# EAGLE schematic untitled (EAGLE 9.6.2)
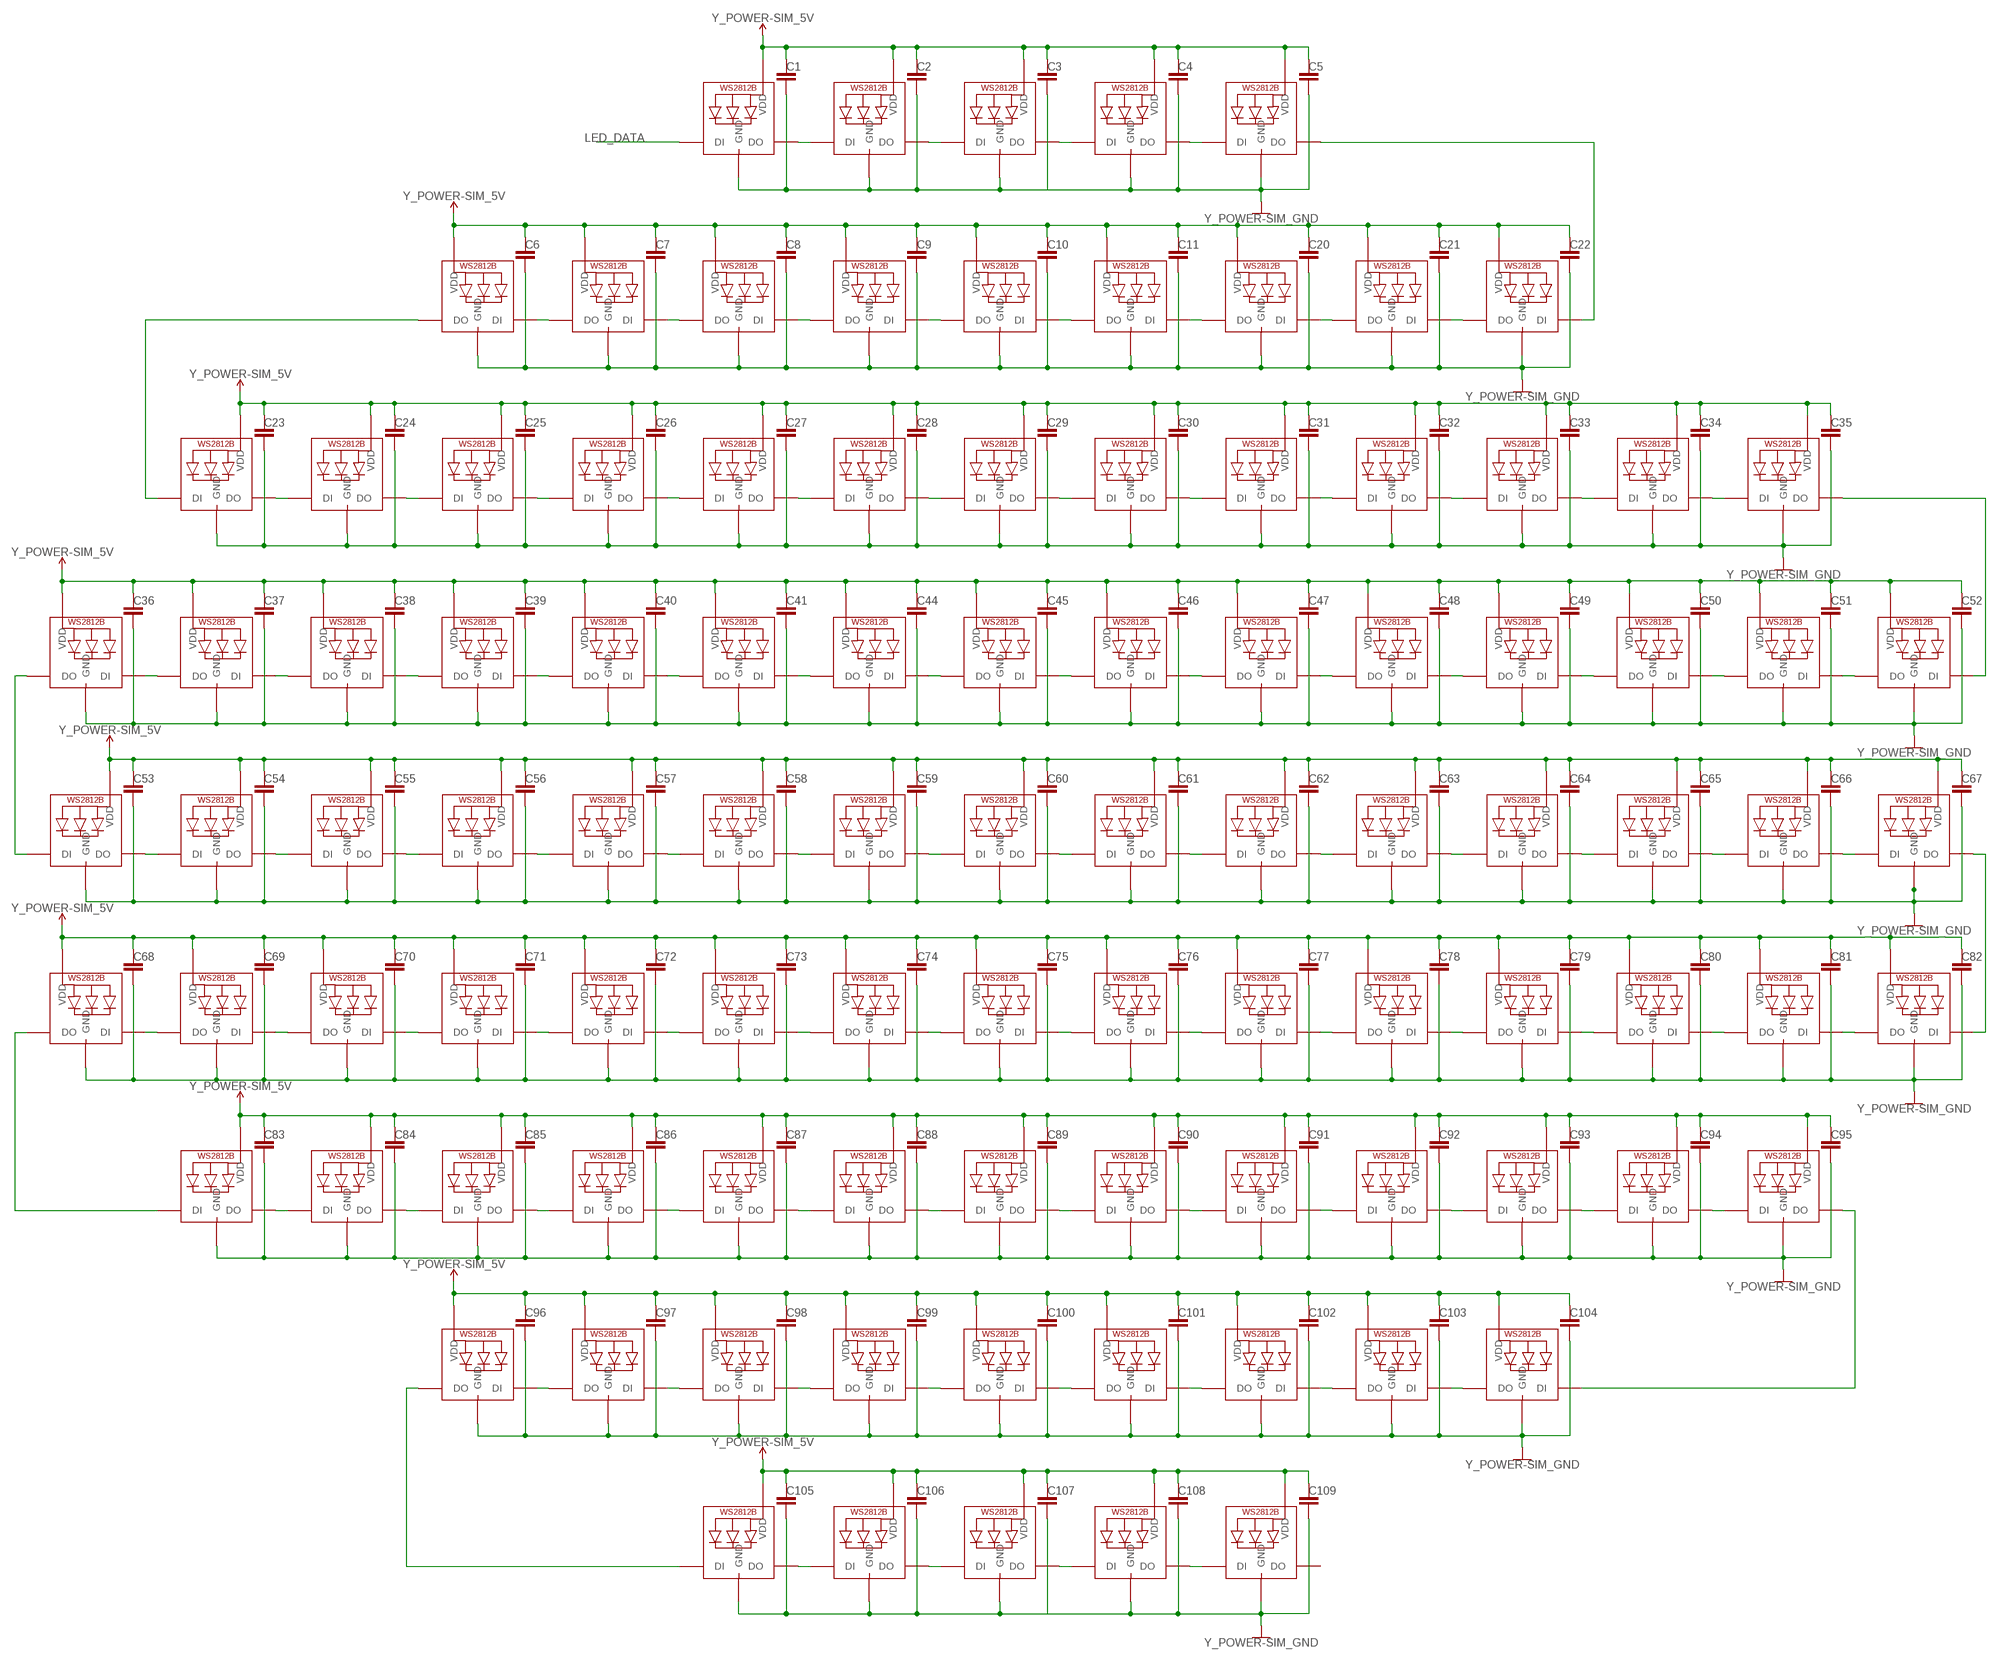
[diagram p0: schematic, sheet 1, part 1 of 2]
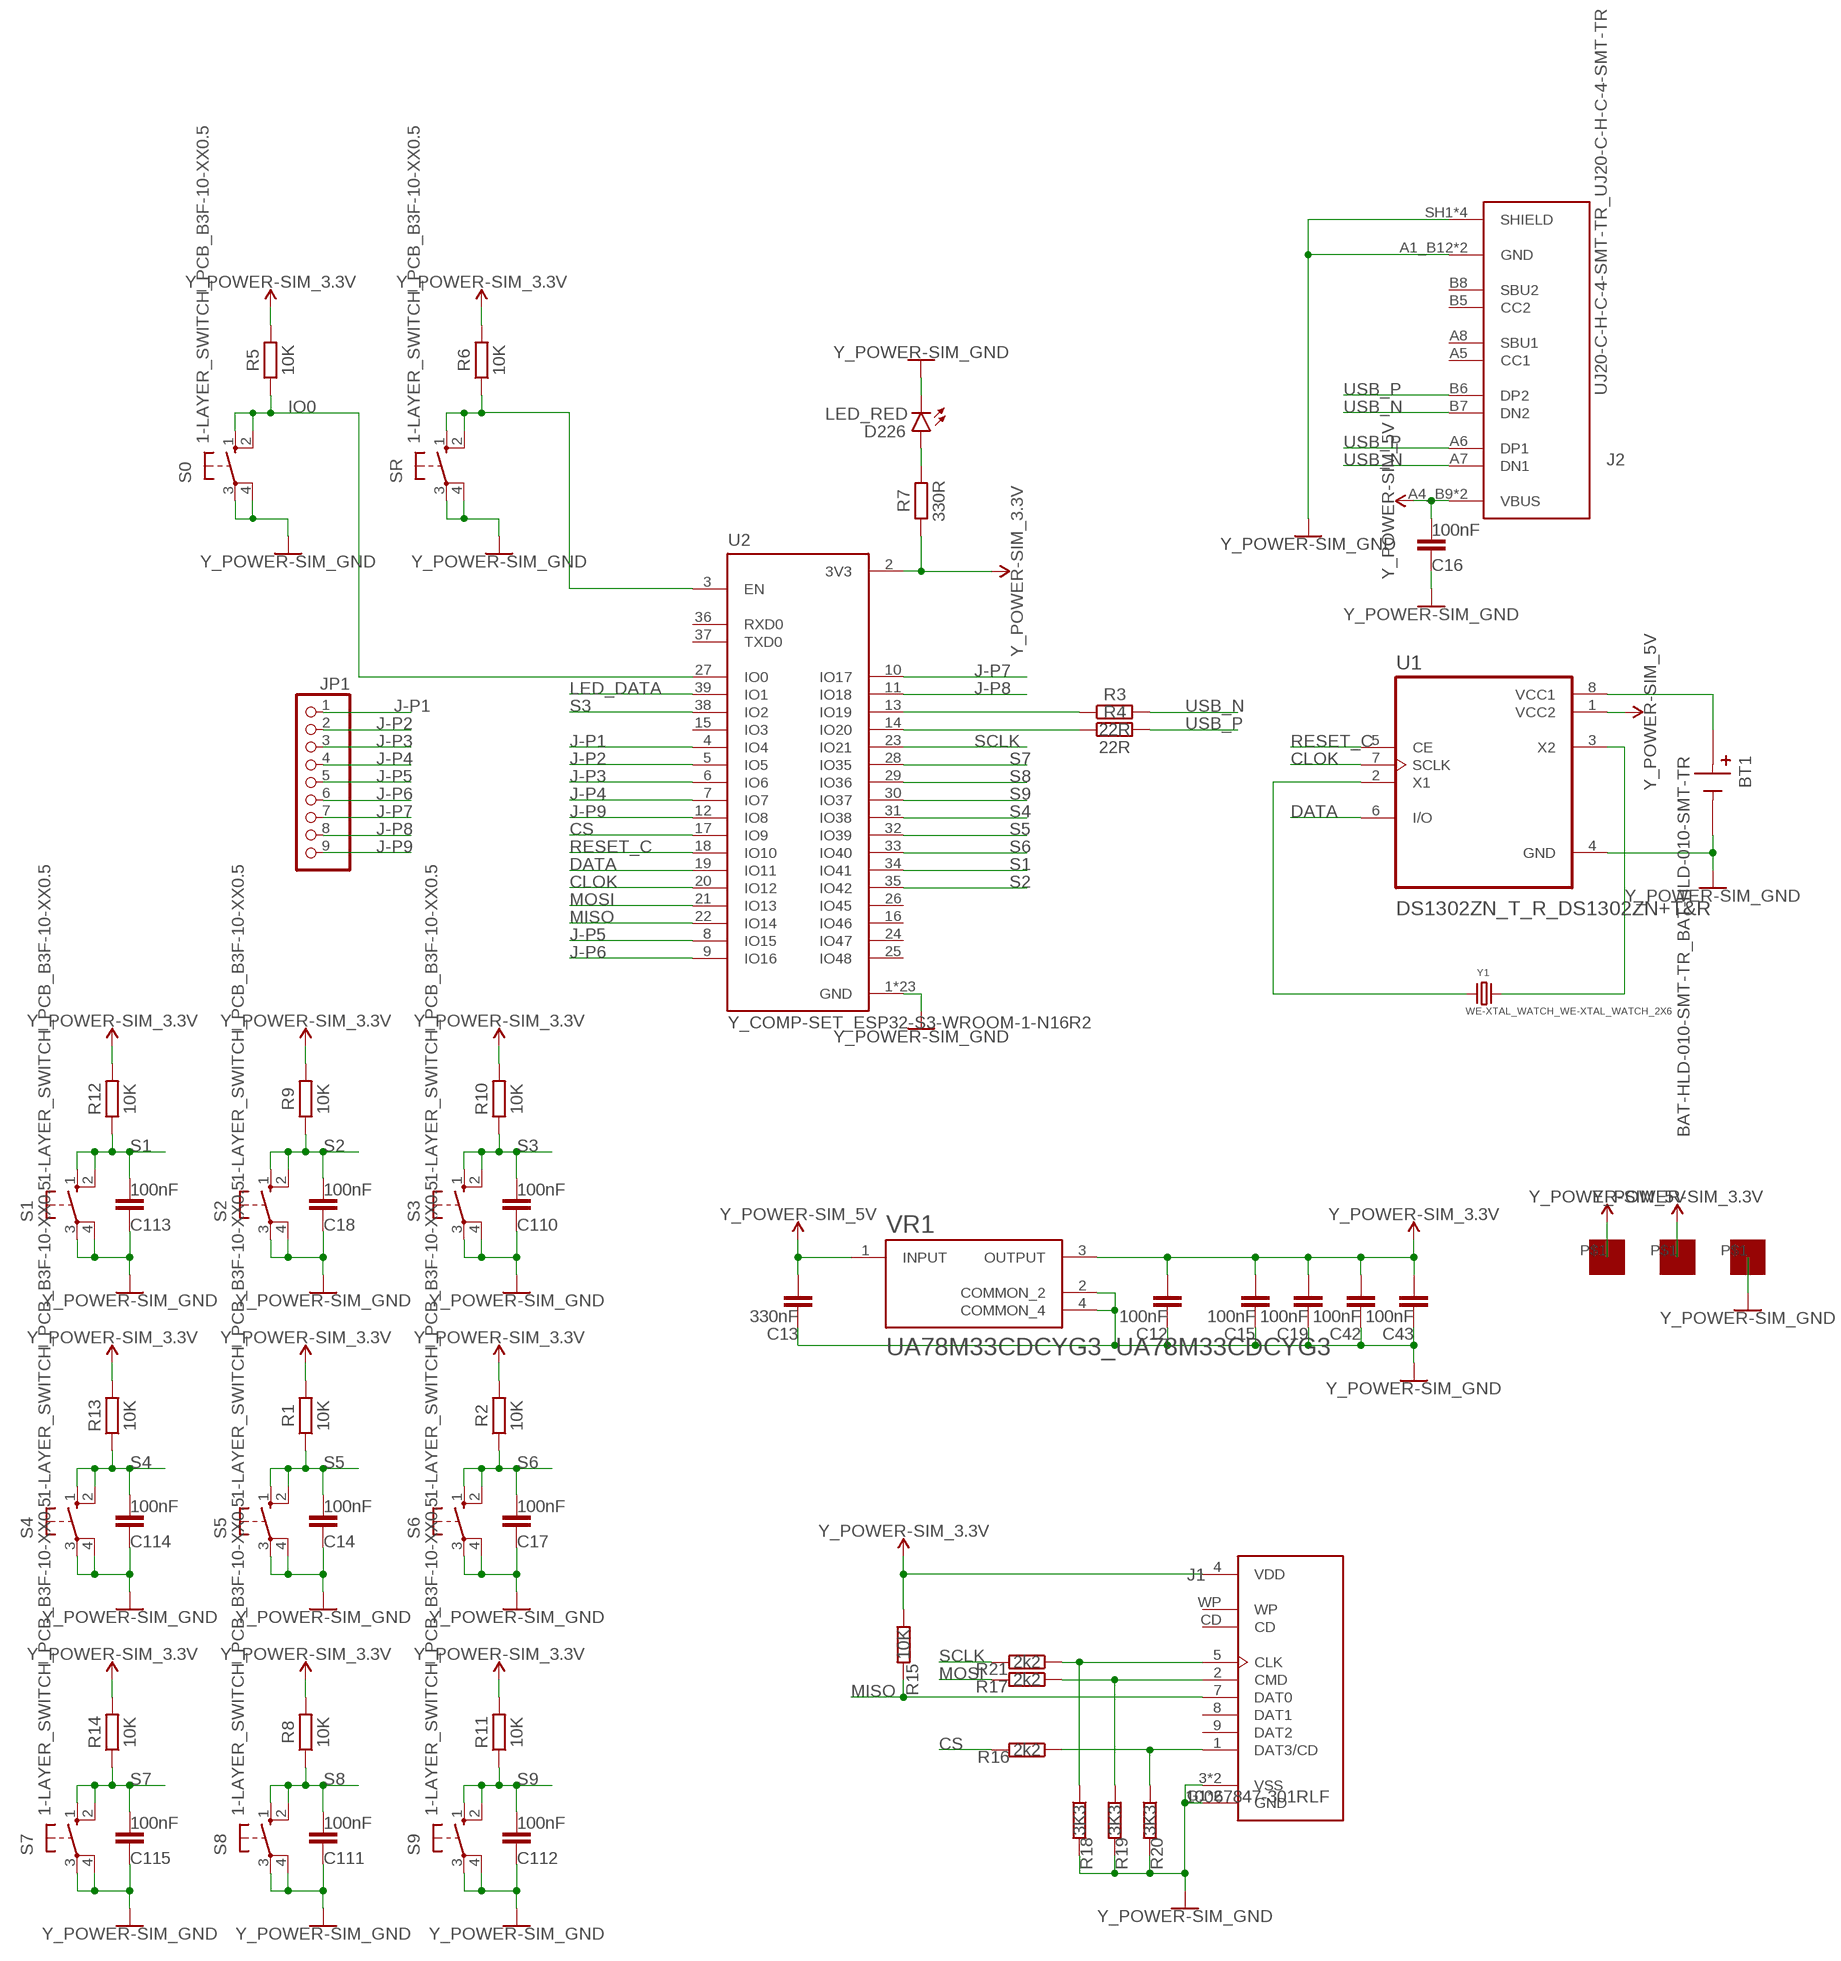
[diagram p1: schematic, sheet 1, part 2 of 2]

## Parts
BT1  BAT-HLD-010-SMT-TR_BAT-HLD-010-SMT-TR  [BAT-HLD-010-SMT-TR_BAT_BAT-HLD-010-SMT-TR]
C1  Y-CAP_C_CHIP-0805(2012-METRIC)  [Y-CAP_CAPC2012X110]
C2  Y-CAP_C_CHIP-0805(2012-METRIC)  [Y-CAP_CAPC2012X110]
C3  Y-CAP_C_CHIP-0805(2012-METRIC)  [Y-CAP_CAPC2012X110]
C4  Y-CAP_C_CHIP-0805(2012-METRIC)  [Y-CAP_CAPC2012X110]
C5  Y-CAP_C_CHIP-0805(2012-METRIC)  [Y-CAP_CAPC2012X110]
C6  Y-CAP_C_CHIP-0805(2012-METRIC)  [Y-CAP_CAPC2012X110]
C7  Y-CAP_C_CHIP-0805(2012-METRIC)  [Y-CAP_CAPC2012X110]
C8  Y-CAP_C_CHIP-0805(2012-METRIC)  [Y-CAP_CAPC2012X110]
C9  Y-CAP_C_CHIP-0805(2012-METRIC)  [Y-CAP_CAPC2012X110]
C10  Y-CAP_C_CHIP-0805(2012-METRIC)  [Y-CAP_CAPC2012X110]
C11  Y-CAP_C_CHIP-0805(2012-METRIC)  [Y-CAP_CAPC2012X110]
C12  100nF  Y-CAP_C_CHIP-0805(2012-METRIC)  [Y-CAP_CAPC2012X110]
C13  330nF  Y-CAP_C_CHIP-0805(2012-METRIC)  [Y-CAP_CAPC2012X110]
C14  100nF  Y-CAP_C_CHIP-0805(2012-METRIC)  [Y-CAP_CAPC2012X110]
C15  100nF  Y-CAP_C_CHIP-0805(2012-METRIC)  [Y-CAP_CAPC2012X110]
C16  100nF  Y-CAP_C_CHIP-0805(2012-METRIC)  [Y-CAP_CAPC2012X110]
C17  100nF  Y-CAP_C_CHIP-0805(2012-METRIC)  [Y-CAP_CAPC2012X110]
C18  100nF  Y-CAP_C_CHIP-0805(2012-METRIC)  [Y-CAP_CAPC2012X110]
C19  100nF  Y-CAP_C_CHIP-0805(2012-METRIC)  [Y-CAP_CAPC2012X110]
C20  Y-CAP_C_CHIP-0805(2012-METRIC)  [Y-CAP_CAPC2012X110]
C21  Y-CAP_C_CHIP-0805(2012-METRIC)  [Y-CAP_CAPC2012X110]
C22  Y-CAP_C_CHIP-0805(2012-METRIC)  [Y-CAP_CAPC2012X110]
C23  Y-CAP_C_CHIP-0805(2012-METRIC)  [Y-CAP_CAPC2012X110]
C24  Y-CAP_C_CHIP-0805(2012-METRIC)  [Y-CAP_CAPC2012X110]
C25  Y-CAP_C_CHIP-0805(2012-METRIC)  [Y-CAP_CAPC2012X110]
C26  Y-CAP_C_CHIP-0805(2012-METRIC)  [Y-CAP_CAPC2012X110]
C27  Y-CAP_C_CHIP-0805(2012-METRIC)  [Y-CAP_CAPC2012X110]
C28  Y-CAP_C_CHIP-0805(2012-METRIC)  [Y-CAP_CAPC2012X110]
C29  Y-CAP_C_CHIP-0805(2012-METRIC)  [Y-CAP_CAPC2012X110]
C30  Y-CAP_C_CHIP-0805(2012-METRIC)  [Y-CAP_CAPC2012X110]
C31  Y-CAP_C_CHIP-0805(2012-METRIC)  [Y-CAP_CAPC2012X110]
C32  Y-CAP_C_CHIP-0805(2012-METRIC)  [Y-CAP_CAPC2012X110]
C33  Y-CAP_C_CHIP-0805(2012-METRIC)  [Y-CAP_CAPC2012X110]
C34  Y-CAP_C_CHIP-0805(2012-METRIC)  [Y-CAP_CAPC2012X110]
C35  Y-CAP_C_CHIP-0805(2012-METRIC)  [Y-CAP_CAPC2012X110]
C36  Y-CAP_C_CHIP-0805(2012-METRIC)  [Y-CAP_CAPC2012X110]
C37  Y-CAP_C_CHIP-0805(2012-METRIC)  [Y-CAP_CAPC2012X110]
C38  Y-CAP_C_CHIP-0805(2012-METRIC)  [Y-CAP_CAPC2012X110]
C39  Y-CAP_C_CHIP-0805(2012-METRIC)  [Y-CAP_CAPC2012X110]
C40  Y-CAP_C_CHIP-0805(2012-METRIC)  [Y-CAP_CAPC2012X110]
C41  Y-CAP_C_CHIP-0805(2012-METRIC)  [Y-CAP_CAPC2012X110]
C42  100nF  Y-CAP_C_CHIP-0805(2012-METRIC)  [Y-CAP_CAPC2012X110]
C43  100nF  Y-CAP_C_CHIP-0805(2012-METRIC)  [Y-CAP_CAPC2012X110]
C44  Y-CAP_C_CHIP-0805(2012-METRIC)  [Y-CAP_CAPC2012X110]
C45  Y-CAP_C_CHIP-0805(2012-METRIC)  [Y-CAP_CAPC2012X110]
C46  Y-CAP_C_CHIP-0805(2012-METRIC)  [Y-CAP_CAPC2012X110]
C47  Y-CAP_C_CHIP-0805(2012-METRIC)  [Y-CAP_CAPC2012X110]
C48  Y-CAP_C_CHIP-0805(2012-METRIC)  [Y-CAP_CAPC2012X110]
C49  Y-CAP_C_CHIP-0805(2012-METRIC)  [Y-CAP_CAPC2012X110]
C50  Y-CAP_C_CHIP-0805(2012-METRIC)  [Y-CAP_CAPC2012X110]
C51  Y-CAP_C_CHIP-0805(2012-METRIC)  [Y-CAP_CAPC2012X110]
C52  Y-CAP_C_CHIP-0805(2012-METRIC)  [Y-CAP_CAPC2012X110]
C53  Y-CAP_C_CHIP-0805(2012-METRIC)  [Y-CAP_CAPC2012X110]
C54  Y-CAP_C_CHIP-0805(2012-METRIC)  [Y-CAP_CAPC2012X110]
C55  Y-CAP_C_CHIP-0805(2012-METRIC)  [Y-CAP_CAPC2012X110]
C56  Y-CAP_C_CHIP-0805(2012-METRIC)  [Y-CAP_CAPC2012X110]
C57  Y-CAP_C_CHIP-0805(2012-METRIC)  [Y-CAP_CAPC2012X110]
C58  Y-CAP_C_CHIP-0805(2012-METRIC)  [Y-CAP_CAPC2012X110]
C59  Y-CAP_C_CHIP-0805(2012-METRIC)  [Y-CAP_CAPC2012X110]
C60  Y-CAP_C_CHIP-0805(2012-METRIC)  [Y-CAP_CAPC2012X110]
C61  Y-CAP_C_CHIP-0805(2012-METRIC)  [Y-CAP_CAPC2012X110]
C62  Y-CAP_C_CHIP-0805(2012-METRIC)  [Y-CAP_CAPC2012X110]
C63  Y-CAP_C_CHIP-0805(2012-METRIC)  [Y-CAP_CAPC2012X110]
C64  Y-CAP_C_CHIP-0805(2012-METRIC)  [Y-CAP_CAPC2012X110]
C65  Y-CAP_C_CHIP-0805(2012-METRIC)  [Y-CAP_CAPC2012X110]
C66  Y-CAP_C_CHIP-0805(2012-METRIC)  [Y-CAP_CAPC2012X110]
C67  Y-CAP_C_CHIP-0805(2012-METRIC)  [Y-CAP_CAPC2012X110]
C68  Y-CAP_C_CHIP-0805(2012-METRIC)  [Y-CAP_CAPC2012X110]
C69  Y-CAP_C_CHIP-0805(2012-METRIC)  [Y-CAP_CAPC2012X110]
C70  Y-CAP_C_CHIP-0805(2012-METRIC)  [Y-CAP_CAPC2012X110]
C71  Y-CAP_C_CHIP-0805(2012-METRIC)  [Y-CAP_CAPC2012X110]
C72  Y-CAP_C_CHIP-0805(2012-METRIC)  [Y-CAP_CAPC2012X110]
C73  Y-CAP_C_CHIP-0805(2012-METRIC)  [Y-CAP_CAPC2012X110]
C74  Y-CAP_C_CHIP-0805(2012-METRIC)  [Y-CAP_CAPC2012X110]
C75  Y-CAP_C_CHIP-0805(2012-METRIC)  [Y-CAP_CAPC2012X110]
C76  Y-CAP_C_CHIP-0805(2012-METRIC)  [Y-CAP_CAPC2012X110]
C77  Y-CAP_C_CHIP-0805(2012-METRIC)  [Y-CAP_CAPC2012X110]
C78  Y-CAP_C_CHIP-0805(2012-METRIC)  [Y-CAP_CAPC2012X110]
C79  Y-CAP_C_CHIP-0805(2012-METRIC)  [Y-CAP_CAPC2012X110]
C80  Y-CAP_C_CHIP-0805(2012-METRIC)  [Y-CAP_CAPC2012X110]
C81  Y-CAP_C_CHIP-0805(2012-METRIC)  [Y-CAP_CAPC2012X110]
C82  Y-CAP_C_CHIP-0805(2012-METRIC)  [Y-CAP_CAPC2012X110]
C83  Y-CAP_C_CHIP-0805(2012-METRIC)  [Y-CAP_CAPC2012X110]
C84  Y-CAP_C_CHIP-0805(2012-METRIC)  [Y-CAP_CAPC2012X110]
C85  Y-CAP_C_CHIP-0805(2012-METRIC)  [Y-CAP_CAPC2012X110]
C86  Y-CAP_C_CHIP-0805(2012-METRIC)  [Y-CAP_CAPC2012X110]
C87  Y-CAP_C_CHIP-0805(2012-METRIC)  [Y-CAP_CAPC2012X110]
C88  Y-CAP_C_CHIP-0805(2012-METRIC)  [Y-CAP_CAPC2012X110]
C89  Y-CAP_C_CHIP-0805(2012-METRIC)  [Y-CAP_CAPC2012X110]
C90  Y-CAP_C_CHIP-0805(2012-METRIC)  [Y-CAP_CAPC2012X110]
C91  Y-CAP_C_CHIP-0805(2012-METRIC)  [Y-CAP_CAPC2012X110]
C92  Y-CAP_C_CHIP-0805(2012-METRIC)  [Y-CAP_CAPC2012X110]
C93  Y-CAP_C_CHIP-0805(2012-METRIC)  [Y-CAP_CAPC2012X110]
C94  Y-CAP_C_CHIP-0805(2012-METRIC)  [Y-CAP_CAPC2012X110]
C95  Y-CAP_C_CHIP-0805(2012-METRIC)  [Y-CAP_CAPC2012X110]
C96  Y-CAP_C_CHIP-0805(2012-METRIC)  [Y-CAP_CAPC2012X110]
C97  Y-CAP_C_CHIP-0805(2012-METRIC)  [Y-CAP_CAPC2012X110]
C98  Y-CAP_C_CHIP-0805(2012-METRIC)  [Y-CAP_CAPC2012X110]
C99  Y-CAP_C_CHIP-0805(2012-METRIC)  [Y-CAP_CAPC2012X110]
C100  Y-CAP_C_CHIP-0805(2012-METRIC)  [Y-CAP_CAPC2012X110]
C101  Y-CAP_C_CHIP-0805(2012-METRIC)  [Y-CAP_CAPC2012X110]
C102  Y-CAP_C_CHIP-0805(2012-METRIC)  [Y-CAP_CAPC2012X110]
C103  Y-CAP_C_CHIP-0805(2012-METRIC)  [Y-CAP_CAPC2012X110]
C104  Y-CAP_C_CHIP-0805(2012-METRIC)  [Y-CAP_CAPC2012X110]
C105  Y-CAP_C_CHIP-0805(2012-METRIC)  [Y-CAP_CAPC2012X110]
C106  Y-CAP_C_CHIP-0805(2012-METRIC)  [Y-CAP_CAPC2012X110]
C107  Y-CAP_C_CHIP-0805(2012-METRIC)  [Y-CAP_CAPC2012X110]
C108  Y-CAP_C_CHIP-0805(2012-METRIC)  [Y-CAP_CAPC2012X110]
C109  Y-CAP_C_CHIP-0805(2012-METRIC)  [Y-CAP_CAPC2012X110]
C110  100nF  Y-CAP_C_CHIP-0805(2012-METRIC)  [Y-CAP_CAPC2012X110]
C111  100nF  Y-CAP_C_CHIP-0805(2012-METRIC)  [Y-CAP_CAPC2012X110]
C112  100nF  Y-CAP_C_CHIP-0805(2012-METRIC)  [Y-CAP_CAPC2012X110]
C113  100nF  Y-CAP_C_CHIP-0805(2012-METRIC)  [Y-CAP_CAPC2012X110]
C114  100nF  Y-CAP_C_CHIP-0805(2012-METRIC)  [Y-CAP_CAPC2012X110]
C115  100nF  Y-CAP_C_CHIP-0805(2012-METRIC)  [Y-CAP_CAPC2012X110]
D226  LED_RED  1-LAYER_LED/R/5MM_0.5  [1-LAYER_LED5MM/R-ROC]
J1  10067847-301RLF  [AMPHENOL_10067847-301RLF]
J2  UJ20-C-H-C-4-SMT-TR_UJ20-C-H-C-4-SMT-TR  [UJ20-C-H-C-4-SMT-TR_CUI_UJ20-C-H-C-4-SMT-TR]
JP1  1-LAYER_PINHD-1X9  [1-LAYER_1X09]
LED1  WS2812B_WS2812B_5050N  [WS2812B_WS2812B-NARROW]
LED2  WS2812B_WS2812B_5050N  [WS2812B_WS2812B-NARROW]
LED3  WS2812B_WS2812B_5050N  [WS2812B_WS2812B-NARROW]
LED4  WS2812B_WS2812B_5050N  [WS2812B_WS2812B-NARROW]
LED5  WS2812B_WS2812B_5050N  [WS2812B_WS2812B-NARROW]
LED6  WS2812B_WS2812B_5050N  [WS2812B_WS2812B-NARROW]
LED7  WS2812B_WS2812B_5050N  [WS2812B_WS2812B-NARROW]
LED8  WS2812B_WS2812B_5050N  [WS2812B_WS2812B-NARROW]
LED9  WS2812B_WS2812B_5050N  [WS2812B_WS2812B-NARROW]
LED10  WS2812B_WS2812B_5050N  [WS2812B_WS2812B-NARROW]
LED11  WS2812B_WS2812B_5050N  [WS2812B_WS2812B-NARROW]
LED12  WS2812B_WS2812B_5050N  [WS2812B_WS2812B-NARROW]
LED13  WS2812B_WS2812B_5050N  [WS2812B_WS2812B-NARROW]
LED14  WS2812B_WS2812B_5050N  [WS2812B_WS2812B-NARROW]
LED15  WS2812B_WS2812B_5050N  [WS2812B_WS2812B-NARROW]
LED16  WS2812B_WS2812B_5050N  [WS2812B_WS2812B-NARROW]
LED17  WS2812B_WS2812B_5050N  [WS2812B_WS2812B-NARROW]
LED18  WS2812B_WS2812B_5050N  [WS2812B_WS2812B-NARROW]
LED19  WS2812B_WS2812B_5050N  [WS2812B_WS2812B-NARROW]
LED20  WS2812B_WS2812B_5050N  [WS2812B_WS2812B-NARROW]
LED21  WS2812B_WS2812B_5050N  [WS2812B_WS2812B-NARROW]
LED22  WS2812B_WS2812B_5050N  [WS2812B_WS2812B-NARROW]
LED23  WS2812B_WS2812B_5050N  [WS2812B_WS2812B-NARROW]
LED24  WS2812B_WS2812B_5050N  [WS2812B_WS2812B-NARROW]
LED25  WS2812B_WS2812B_5050N  [WS2812B_WS2812B-NARROW]
LED26  WS2812B_WS2812B_5050N  [WS2812B_WS2812B-NARROW]
LED27  WS2812B_WS2812B_5050N  [WS2812B_WS2812B-NARROW]
LED28  WS2812B_WS2812B_5050N  [WS2812B_WS2812B-NARROW]
LED29  WS2812B_WS2812B_5050N  [WS2812B_WS2812B-NARROW]
LED30  WS2812B_WS2812B_5050N  [WS2812B_WS2812B-NARROW]
LED31  WS2812B_WS2812B_5050N  [WS2812B_WS2812B-NARROW]
LED32  WS2812B_WS2812B_5050N  [WS2812B_WS2812B-NARROW]
LED33  WS2812B_WS2812B_5050N  [WS2812B_WS2812B-NARROW]
LED34  WS2812B_WS2812B_5050N  [WS2812B_WS2812B-NARROW]
LED35  WS2812B_WS2812B_5050N  [WS2812B_WS2812B-NARROW]
LED36  WS2812B_WS2812B_5050N  [WS2812B_WS2812B-NARROW]
LED37  WS2812B_WS2812B_5050N  [WS2812B_WS2812B-NARROW]
LED38  WS2812B_WS2812B_5050N  [WS2812B_WS2812B-NARROW]
LED39  WS2812B_WS2812B_5050N  [WS2812B_WS2812B-NARROW]
LED40  WS2812B_WS2812B_5050N  [WS2812B_WS2812B-NARROW]
LED41  WS2812B_WS2812B_5050N  [WS2812B_WS2812B-NARROW]
LED42  WS2812B_WS2812B_5050N  [WS2812B_WS2812B-NARROW]
LED43  WS2812B_WS2812B_5050N  [WS2812B_WS2812B-NARROW]
LED44  WS2812B_WS2812B_5050N  [WS2812B_WS2812B-NARROW]
LED45  WS2812B_WS2812B_5050N  [WS2812B_WS2812B-NARROW]
LED46  WS2812B_WS2812B_5050N  [WS2812B_WS2812B-NARROW]
LED47  WS2812B_WS2812B_5050N  [WS2812B_WS2812B-NARROW]
LED48  WS2812B_WS2812B_5050N  [WS2812B_WS2812B-NARROW]
LED49  WS2812B_WS2812B_5050N  [WS2812B_WS2812B-NARROW]
LED50  WS2812B_WS2812B_5050N  [WS2812B_WS2812B-NARROW]
LED51  WS2812B_WS2812B_5050N  [WS2812B_WS2812B-NARROW]
LED52  WS2812B_WS2812B_5050N  [WS2812B_WS2812B-NARROW]
LED53  WS2812B_WS2812B_5050N  [WS2812B_WS2812B-NARROW]
LED54  WS2812B_WS2812B_5050N  [WS2812B_WS2812B-NARROW]
LED55  WS2812B_WS2812B_5050N  [WS2812B_WS2812B-NARROW]
LED56  WS2812B_WS2812B_5050N  [WS2812B_WS2812B-NARROW]
LED57  WS2812B_WS2812B_5050N  [WS2812B_WS2812B-NARROW]
LED58  WS2812B_WS2812B_5050N  [WS2812B_WS2812B-NARROW]
LED59  WS2812B_WS2812B_5050N  [WS2812B_WS2812B-NARROW]
LED60  WS2812B_WS2812B_5050N  [WS2812B_WS2812B-NARROW]
LED61  WS2812B_WS2812B_5050N  [WS2812B_WS2812B-NARROW]
LED62  WS2812B_WS2812B_5050N  [WS2812B_WS2812B-NARROW]
LED63  WS2812B_WS2812B_5050N  [WS2812B_WS2812B-NARROW]
LED64  WS2812B_WS2812B_5050N  [WS2812B_WS2812B-NARROW]
LED65  WS2812B_WS2812B_5050N  [WS2812B_WS2812B-NARROW]
LED66  WS2812B_WS2812B_5050N  [WS2812B_WS2812B-NARROW]
LED67  WS2812B_WS2812B_5050N  [WS2812B_WS2812B-NARROW]
LED68  WS2812B_WS2812B_5050N  [WS2812B_WS2812B-NARROW]
LED69  WS2812B_WS2812B_5050N  [WS2812B_WS2812B-NARROW]
LED70  WS2812B_WS2812B_5050N  [WS2812B_WS2812B-NARROW]
LED71  WS2812B_WS2812B_5050N  [WS2812B_WS2812B-NARROW]
LED72  WS2812B_WS2812B_5050N  [WS2812B_WS2812B-NARROW]
LED73  WS2812B_WS2812B_5050N  [WS2812B_WS2812B-NARROW]
LED74  WS2812B_WS2812B_5050N  [WS2812B_WS2812B-NARROW]
LED75  WS2812B_WS2812B_5050N  [WS2812B_WS2812B-NARROW]
LED76  WS2812B_WS2812B_5050N  [WS2812B_WS2812B-NARROW]
LED77  WS2812B_WS2812B_5050N  [WS2812B_WS2812B-NARROW]
LED78  WS2812B_WS2812B_5050N  [WS2812B_WS2812B-NARROW]
LED79  WS2812B_WS2812B_5050N  [WS2812B_WS2812B-NARROW]
LED80  WS2812B_WS2812B_5050N  [WS2812B_WS2812B-NARROW]
LED81  WS2812B_WS2812B_5050N  [WS2812B_WS2812B-NARROW]
LED82  WS2812B_WS2812B_5050N  [WS2812B_WS2812B-NARROW]
LED83  WS2812B_WS2812B_5050N  [WS2812B_WS2812B-NARROW]
LED84  WS2812B_WS2812B_5050N  [WS2812B_WS2812B-NARROW]
LED85  WS2812B_WS2812B_5050N  [WS2812B_WS2812B-NARROW]
LED86  WS2812B_WS2812B_5050N  [WS2812B_WS2812B-NARROW]
LED87  WS2812B_WS2812B_5050N  [WS2812B_WS2812B-NARROW]
LED88  WS2812B_WS2812B_5050N  [WS2812B_WS2812B-NARROW]
LED89  WS2812B_WS2812B_5050N  [WS2812B_WS2812B-NARROW]
LED90  WS2812B_WS2812B_5050N  [WS2812B_WS2812B-NARROW]
LED91  WS2812B_WS2812B_5050N  [WS2812B_WS2812B-NARROW]
LED92  WS2812B_WS2812B_5050N  [WS2812B_WS2812B-NARROW]
LED93  WS2812B_WS2812B_5050N  [WS2812B_WS2812B-NARROW]
LED94  WS2812B_WS2812B_5050N  [WS2812B_WS2812B-NARROW]
LED95  WS2812B_WS2812B_5050N  [WS2812B_WS2812B-NARROW]
LED96  WS2812B_WS2812B_5050N  [WS2812B_WS2812B-NARROW]
LED97  WS2812B_WS2812B_5050N  [WS2812B_WS2812B-NARROW]
LED98  WS2812B_WS2812B_5050N  [WS2812B_WS2812B-NARROW]
LED99  WS2812B_WS2812B_5050N  [WS2812B_WS2812B-NARROW]
R1  10K  Y-RES_R_CHIP-0805(2012-METRIC)  [Y-RES_RESC2012X65]
R2  10K  Y-RES_R_CHIP-0805(2012-METRIC)  [Y-RES_RESC2012X65]
R3  22R  Y-RES_R_CHIP-0805(2012-METRIC)  [Y-RES_RESC2012X65]
R4  22R  Y-RES_R_CHIP-0805(2012-METRIC)  [Y-RES_RESC2012X65]
R5  10K  Y-RES_R_CHIP-0805(2012-METRIC)  [Y-RES_RESC2012X65]
R6  10K  Y-RES_R_CHIP-0805(2012-METRIC)  [Y-RES_RESC2012X65]
R7  330R  Y-RES_R_CHIP-0805(2012-METRIC)  [Y-RES_RESC2012X65]
R8  10K  Y-RES_R_CHIP-0805(2012-METRIC)  [Y-RES_RESC2012X65]
R9  10K  Y-RES_R_CHIP-0805(2012-METRIC)  [Y-RES_RESC2012X65]
R10  10K  Y-RES_R_CHIP-0805(2012-METRIC)  [Y-RES_RESC2012X65]
R11  10K  Y-RES_R_CHIP-0805(2012-METRIC)  [Y-RES_RESC2012X65]
R12  10K  Y-RES_R_CHIP-0805(2012-METRIC)  [Y-RES_RESC2012X65]
R13  10K  Y-RES_R_CHIP-0805(2012-METRIC)  [Y-RES_RESC2012X65]
R14  10K  Y-RES_R_CHIP-0805(2012-METRIC)  [Y-RES_RESC2012X65]
R15  10K  Y-RES_R_CHIP-0805(2012-METRIC)  [Y-RES_RESC2012X65]
R16  2k2  Y-RES_R_CHIP-0805(2012-METRIC)  [Y-RES_RESC2012X65]
R17  2k2  Y-RES_R_CHIP-0805(2012-METRIC)  [Y-RES_RESC2012X65]
R18  3K3  Y-RES_R_CHIP-0805(2012-METRIC)  [Y-RES_RESC2012X65]
R19  3K3  Y-RES_R_CHIP-0805(2012-METRIC)  [Y-RES_RESC2012X65]
R20  3K3  Y-RES_R_CHIP-0805(2012-METRIC)  [Y-RES_RESC2012X65]
R21  2k2  Y-RES_R_CHIP-0805(2012-METRIC)  [Y-RES_RESC2012X65]
S0  1-LAYER_SWITCH_PCB_B3F-10-XX0.5  [1-LAYER_B3F-10XXROC]
S1  1-LAYER_SWITCH_PCB_B3F-10-XX0.5  [1-LAYER_B3F-10XXROC]
S2  1-LAYER_SWITCH_PCB_B3F-10-XX0.5  [1-LAYER_B3F-10XXROC]
S3  1-LAYER_SWITCH_PCB_B3F-10-XX0.5  [1-LAYER_B3F-10XXROC]
S4  1-LAYER_SWITCH_PCB_B3F-10-XX0.5  [1-LAYER_B3F-10XXROC]
S5  1-LAYER_SWITCH_PCB_B3F-10-XX0.5  [1-LAYER_B3F-10XXROC]
S6  1-LAYER_SWITCH_PCB_B3F-10-XX0.5  [1-LAYER_B3F-10XXROC]
S7  1-LAYER_SWITCH_PCB_B3F-10-XX0.5  [1-LAYER_B3F-10XXROC]
S8  1-LAYER_SWITCH_PCB_B3F-10-XX0.5  [1-LAYER_B3F-10XXROC]
S9  1-LAYER_SWITCH_PCB_B3F-10-XX0.5  [1-LAYER_B3F-10XXROC]
SR  1-LAYER_SWITCH_PCB_B3F-10-XX0.5  [1-LAYER_B3F-10XXROC]
U1  DS1302ZN_T_R_DS1302ZN+T&R  [DS1302ZN_T_R_SOIC127P600X175-8N]
U2  Y_COMP-SET_ESP32-S3-WROOM-1-N16R2  [Y_COMP-SET_XCVR_ESP32-S3-WROOM-1-N16R2]
U$1  Y_CONECTOR_POGOPAD2  [Y_CONECTOR_POGOPAD_50]
U$2  Y_CONECTOR_POGOPAD2  [Y_CONECTOR_POGOPAD_50]
U$3  Y_CONECTOR_POGOPAD2  [Y_CONECTOR_POGOPAD_50]
VR1  UA78M33CDCYG3_UA78M33CDCYG3  [UA78M33CDCYG3_VREG_UA78M33CDCYG3]
Y1  WE-XTAL_WATCH_WE-XTAL_WATCH_2X6  [WE-XTAL_WATCH_WE-XTAL_WATCH-2X6]

## Nets
3.3V: C12.2 C15.2 C19.2 C42.2 C43.2 J1.4(VDD) R1.2 R2.2 R5.2 R6.2 R7.1 R8.2 R9.2 R10.2 R11.2 R12.2 R13.2 R14.2 R15.1 U2.2(3V3) U$1.P$1 VR1.3(OUTPUT) ; supply symbol labelled Y_POWER-SIM_3.3V
5V [power]: C1.1 C2.1 C3.1 C4.1 C5.1 C6.1 C7.1 C8.1 C9.1 C10.1 C11.1 C13.2 C16.2 C20.1 C21.1 C22.1 C23.1 C24.1 C25.1 C26.1 C27.1 C28.1 C29.1 C30.1 C31.1 C32.1 C33.1 C34.1 C35.1 C36.1 C37.1 C38.1 C39.1 C40.1 C41.1 C44.1 C45.1 C46.1 C47.1 C48.1 C49.1 C50.1 C51.1 C52.1 C53.1 C54.1 C55.1 C56.1 C57.1 C58.1 C59.1 C60.1 C61.1 C62.1 C63.1 C64.1 C65.1 C66.1 C67.1 C68.1 C69.1 C70.1 C71.1 C72.1 C73.1 C74.1 C75.1 C76.1 C77.1 C78.1 C79.1 C80.1 C81.1 C82.1 C83.1 C84.1 C85.1 C86.1 C87.1 C88.1 C89.1 C90.1 C91.1 C92.1 C93.1 C94.1 C95.1 C96.1 C97.1 C98.1 C99.1 C100.1 C101.1 C102.1 C103.1 C104.1 C105.1 C106.1 C107.1 C108.1 C109.1 J2.A4_B9(VBUS) J2.A9_B4(VBUS) LED1.1-VDD(VDD) LED2.1-VDD(VDD) LED3.1-VDD(VDD) LED4.1-VDD(VDD) LED5.1-VDD(VDD) LED6.1-VDD(VDD) LED7.1-VDD(VDD) LED8.1-VDD(VDD) LED9.1-VDD(VDD) LED10.1-VDD(VDD) LED11.1-VDD(VDD) LED12.1-VDD(VDD) LED13.1-VDD(VDD) LED14.1-VDD(VDD) LED15.1-VDD(VDD) LED16.1-VDD(VDD) LED17.1-VDD(VDD) LED18.1-VDD(VDD) LED19.1-VDD(VDD) LED20.1-VDD(VDD) LED21.1-VDD(VDD) LED22.1-VDD(VDD) LED23.1-VDD(VDD) LED24.1-VDD(VDD) LED25.1-VDD(VDD) LED26.1-VDD(VDD) LED27.1-VDD(VDD) LED28.1-VDD(VDD) LED29.1-VDD(VDD) LED30.1-VDD(VDD) LED31.1-VDD(VDD) LED32.1-VDD(VDD) LED33.1-VDD(VDD) LED34.1-VDD(VDD) LED35.1-VDD(VDD) LED36.1-VDD(VDD) LED37.1-VDD(VDD) LED38.1-VDD(VDD) LED39.1-VDD(VDD) LED40.1-VDD(VDD) LED41.1-VDD(VDD) LED42.1-VDD(VDD) LED43.1-VDD(VDD) LED44.1-VDD(VDD) LED45.1-VDD(VDD) LED46.1-VDD(VDD) LED47.1-VDD(VDD) LED48.1-VDD(VDD) LED49.1-VDD(VDD) LED50.1-VDD(VDD) LED51.1-VDD(VDD) LED52.1-VDD(VDD) LED53.1-VDD(VDD) LED54.1-VDD(VDD) LED55.1-VDD(VDD) LED56.1-VDD(VDD) LED57.1-VDD(VDD) LED58.1-VDD(VDD) LED59.1-VDD(VDD) LED60.1-VDD(VDD) LED61.1-VDD(VDD) LED62.1-VDD(VDD) LED63.1-VDD(VDD) LED64.1-VDD(VDD) LED65.1-VDD(VDD) LED66.1-VDD(VDD) LED67.1-VDD(VDD) LED68.1-VDD(VDD) LED69.1-VDD(VDD) LED70.1-VDD(VDD) LED71.1-VDD(VDD) LED72.1-VDD(VDD) LED73.1-VDD(VDD) LED74.1-VDD(VDD) LED75.1-VDD(VDD) LED76.1-VDD(VDD) LED77.1-VDD(VDD) LED78.1-VDD(VDD) LED79.1-VDD(VDD) LED80.1-VDD(VDD) LED81.1-VDD(VDD) LED82.1-VDD(VDD) LED83.1-VDD(VDD) LED84.1-VDD(VDD) LED85.1-VDD(VDD) LED86.1-VDD(VDD) LED87.1-VDD(VDD) LED88.1-VDD(VDD) LED89.1-VDD(VDD) LED90.1-VDD(VDD) LED91.1-VDD(VDD) LED92.1-VDD(VDD) LED93.1-VDD(VDD) LED94.1-VDD(VDD) LED95.1-VDD(VDD) LED96.1-VDD(VDD) LED97.1-VDD(VDD) LED98.1-VDD(VDD) LED99.1-VDD(VDD) U1.1(VCC2) U$3.P$1 VR1.1(INPUT) ; supply symbol labelled Y_POWER-SIM_5V
CLOK: U1.7(SCLK) U2.20(IO12)
CS: R16.2 U2.17(IO9)
DATA: U1.6(I/O) U2.19(IO11)
GND: BT1.N C1.2 C2.2 C3.2 C4.2 C5.2 C6.2 C7.2 C8.2 C9.2 C10.2 C11.2 C12.1 C13.1 C14.1 C15.1 C16.1 C17.1 C18.1 C19.1 C20.2 C21.2 C22.2 C23.2 C24.2 C25.2 C26.2 C27.2 C28.2 C29.2 C30.2 C31.2 C32.2 C33.2 C34.2 C35.2 C36.2 C37.2 C38.2 C39.2 C40.2 C41.2 C42.1 C43.1 C44.2 C45.2 C46.2 C47.2 C48.2 C49.2 C50.2 C51.2 C52.2 C53.2 C54.2 C55.2 C56.2 C57.2 C58.2 C59.2 C60.2 C61.2 C62.2 C63.2 C64.2 C65.2 C66.2 C67.2 C68.2 C69.2 C70.2 C71.2 C72.2 C73.2 C74.2 C75.2 C76.2 C77.2 C78.2 C79.2 C80.2 C81.2 C82.2 C83.2 C84.2 C85.2 C86.2 C87.2 C88.2 C89.2 C90.2 C91.2 C92.2 C93.2 C94.2 C95.2 C96.2 C97.2 C98.2 C99.2 C100.2 C101.2 C102.2 C103.2 C104.2 C105.2 C106.2 C107.2 C108.2 C109.2 C110.1 C111.1 C112.1 C113.1 C114.1 C115.1 D226.2(C) J1.3(VSS) J1.6(VSS) J1.G1(GND) J1.G2(GND) J2.A1_B12(GND) J2.A12_B1(GND) J2.SH1(SHIELD) J2.SH2(SHIELD) J2.SH3(SHIELD) J2.SH4(SHIELD) LED1.3-GND(GND) LED2.3-GND(GND) LED3.3-GND(GND) LED4.3-GND(GND) LED5.3-GND(GND) LED6.3-GND(GND) LED7.3-GND(GND) LED8.3-GND(GND) LED9.3-GND(GND) LED10.3-GND(GND) LED11.3-GND(GND) LED12.3-GND(GND) LED13.3-GND(GND) LED14.3-GND(GND) LED15.3-GND(GND) LED16.3-GND(GND) LED17.3-GND(GND) LED18.3-GND(GND) LED19.3-GND(GND) LED20.3-GND(GND) LED21.3-GND(GND) LED22.3-GND(GND) LED23.3-GND(GND) LED24.3-GND(GND) LED25.3-GND(GND) LED26.3-GND(GND) LED27.3-GND(GND) LED28.3-GND(GND) LED29.3-GND(GND) LED30.3-GND(GND) LED31.3-GND(GND) LED32.3-GND(GND) LED33.3-GND(GND) LED34.3-GND(GND) LED35.3-GND(GND) LED36.3-GND(GND) LED37.3-GND(GND) LED38.3-GND(GND) LED39.3-GND(GND) LED40.3-GND(GND) LED41.3-GND(GND) LED42.3-GND(GND) LED43.3-GND(GND) LED44.3-GND(GND) LED45.3-GND(GND) LED46.3-GND(GND) LED47.3-GND(GND) LED48.3-GND(GND) LED49.3-GND(GND) LED50.3-GND(GND) LED51.3-GND(GND) LED52.3-GND(GND) LED53.3-GND(GND) LED54.3-GND(GND) LED55.3-GND(GND) LED56.3-GND(GND) LED57.3-GND(GND) LED58.3-GND(GND) LED59.3-GND(GND) LED60.3-GND(GND) LED61.3-GND(GND) LED62.3-GND(GND) LED63.3-GND(GND) LED64.3-GND(GND) LED65.3-GND(GND) LED66.3-GND(GND) LED67.3-GND(GND) LED68.3-GND(GND) LED69.3-GND(GND) LED70.3-GND(GND) LED71.3-GND(GND) LED72.3-GND(GND) LED73.3-GND(GND) LED74.3-GND(GND) LED75.3-GND(GND) LED76.3-GND(GND) LED77.3-GND(GND) LED78.3-GND(GND) LED79.3-GND(GND) LED80.3-GND(GND) LED81.3-GND(GND) LED82.3-GND(GND) LED83.3-GND(GND) LED84.3-GND(GND) LED85.3-GND(GND) LED86.3-GND(GND) LED87.3-GND(GND) LED88.3-GND(GND) LED89.3-GND(GND) LED90.3-GND(GND) LED91.3-GND(GND) LED92.3-GND(GND) LED93.3-GND(GND) LED94.3-GND(GND) LED95.3-GND(GND) LED96.3-GND(GND) LED97.3-GND(GND) LED98.3-GND(GND) LED99.3-GND(GND) R18.2 R19.2 R20.2 S0.3(P) S0.4(P1) S1.3(P) S1.4(P1) S2.3(P) S2.4(P1) S3.3(P) S3.4(P1) S4.3(P) S4.4(P1) S5.3(P) S5.4(P1) S6.3(P) S6.4(P1) S7.3(P) S7.4(P1) S8.3(P) S8.4(P1) S9.3(P) S9.4(P1) SR.3(P) SR.4(P1) U1.4(GND) U2.1(GND) U2.40(GND) U2.41_1(GND) U2.41_2(GND) U2.41_3(GND) U2.41_4(GND) U2.41_5(GND) U2.41_6(GND) U2.41_7(GND) U2.41_8(GND) U2.41_9(GND) U2.41_10(GND) U2.41_11(GND) U2.41_12(GND) U2.41_13(GND) U2.41_14(GND) U2.41_15(GND) U2.41_16(GND) U2.41_17(GND) U2.41_18(GND) U2.41_19(GND) U2.41_20(GND) U2.41_21(GND) U$2.P$1 VR1.2(COMMON_2) VR1.4(COMMON_4) ; supply symbol labelled Y_POWER-SIM_GND
IO0: R5.1 S0.1(S) S0.2(S1) U2.27(IO0)
J-P1: JP1.1 U2.4(IO4)
J-P2: JP1.2 U2.5(IO5)
J-P3: JP1.3 U2.6(IO6)
J-P4: JP1.4 U2.7(IO7)
J-P5: JP1.5 U2.8(IO15)
J-P6: JP1.6 U2.9(IO16)
J-P7: JP1.7 U2.10(IO17)
J-P8: JP1.8 U2.11(IO18)
J-P9: JP1.9 U2.12(IO8)
LED_DATA: LED1.4-DIN(DI) U2.39(IO1)
MISO: J1.7(DAT0) R15.2 U2.22(IO14)
MOSI: R17.2 U2.21(IO13)
N$1: LED1.2-DOUT(DO) LED2.4-DIN(DI)
N$2: LED2.2-DOUT(DO) LED3.4-DIN(DI)
N$3: LED3.2-DOUT(DO) LED4.4-DIN(DI)
N$4: LED4.2-DOUT(DO) LED5.4-DIN(DI)
N$5: LED5.2-DOUT(DO) LED14.4-DIN(DI)
N$6: LED13.4-DIN(DI) LED14.2-DOUT(DO)
N$7: LED12.4-DIN(DI) LED13.2-DOUT(DO)
N$8: LED11.4-DIN(DI) LED12.2-DOUT(DO)
N$9: LED10.4-DIN(DI) LED11.2-DOUT(DO)
N$10: LED9.4-DIN(DI) LED10.2-DOUT(DO)
N$11: LED8.4-DIN(DI) LED9.2-DOUT(DO)
N$12: LED7.4-DIN(DI) LED8.2-DOUT(DO)
N$13: LED6.4-DIN(DI) LED7.2-DOUT(DO)
N$14: LED6.2-DOUT(DO) LED20.4-DIN(DI)
N$15: LED20.2-DOUT(DO) LED21.4-DIN(DI)
N$16: LED21.2-DOUT(DO) LED22.4-DIN(DI)
N$17: LED22.2-DOUT(DO) LED23.4-DIN(DI)
N$18: LED23.2-DOUT(DO) LED24.4-DIN(DI)
N$19: LED15.4-DIN(DI) LED24.2-DOUT(DO)
N$20: LED15.2-DOUT(DO) LED26.4-DIN(DI)
N$21: LED26.2-DOUT(DO) LED32.4-DIN(DI)
N$22: LED32.2-DOUT(DO) LED38.4-DIN(DI)
N$23: LED38.2-DOUT(DO) LED44.4-DIN(DI)
N$24: LED44.2-DOUT(DO) LED55.4-DIN(DI)
N$25: LED55.2-DOUT(DO) LED56.4-DIN(DI)
N$26: LED56.2-DOUT(DO) LED57.4-DIN(DI)
N$27: LED62.4-DIN(DI) LED68.2-DOUT(DO)
N$28: LED61.4-DIN(DI) LED62.2-DOUT(DO)
N$29: LED60.4-DIN(DI) LED61.2-DOUT(DO)
N$30: LED49.4-DIN(DI) LED60.2-DOUT(DO)
N$31: LED48.4-DIN(DI) LED49.2-DOUT(DO)
N$32: LED47.4-DIN(DI) LED48.2-DOUT(DO)
N$33: LED46.4-DIN(DI) LED47.2-DOUT(DO)
N$34: LED45.4-DIN(DI) LED46.2-DOUT(DO)
N$35: LED25.4-DIN(DI) LED45.2-DOUT(DO)
N$36: LED19.4-DIN(DI) LED25.2-DOUT(DO)
N$37: LED18.4-DIN(DI) LED19.2-DOUT(DO)
N$38: LED17.4-DIN(DI) LED18.2-DOUT(DO)
N$39: LED16.4-DIN(DI) LED17.2-DOUT(DO)
N$40: LED16.2-DOUT(DO) LED27.4-DIN(DI)
N$41: LED27.2-DOUT(DO) LED28.4-DIN(DI)
N$42: LED28.2-DOUT(DO) LED29.4-DIN(DI)
N$43: LED29.2-DOUT(DO) LED30.4-DIN(DI)
N$44: LED30.2-DOUT(DO) LED31.4-DIN(DI)
N$45: LED31.2-DOUT(DO) LED50.4-DIN(DI)
N$46: LED50.2-DOUT(DO) LED51.4-DIN(DI)
N$47: LED51.2-DOUT(DO) LED52.4-DIN(DI)
N$48: LED52.2-DOUT(DO) LED53.4-DIN(DI)
N$49: LED53.2-DOUT(DO) LED54.4-DIN(DI)
N$50: LED54.2-DOUT(DO) LED65.4-DIN(DI)
N$51: LED65.2-DOUT(DO) LED66.4-DIN(DI)
N$52: LED66.2-DOUT(DO) LED67.4-DIN(DI)
N$53: LED33.2-DOUT(DO) LED73.4-DIN(DI)
N$54: LED63.4-DIN(DI) LED64.2-DOUT(DO)
N$55: LED59.4-DIN(DI) LED63.2-DOUT(DO)
N$56: LED58.4-DIN(DI) LED59.2-DOUT(DO)
N$57: LED43.4-DIN(DI) LED58.2-DOUT(DO)
N$58: LED42.4-DIN(DI) LED43.2-DOUT(DO)
N$59: LED41.4-DIN(DI) LED42.2-DOUT(DO)
N$60: LED40.4-DIN(DI) LED41.2-DOUT(DO)
N$61: LED39.4-DIN(DI) LED40.2-DOUT(DO)
N$62: LED37.4-DIN(DI) LED39.2-DOUT(DO)
N$63: LED36.4-DIN(DI) LED37.2-DOUT(DO)
N$64: LED35.4-DIN(DI) LED36.2-DOUT(DO)
N$65: LED34.4-DIN(DI) LED35.2-DOUT(DO)
N$66: LED33.4-DIN(DI) LED34.2-DOUT(DO)
N$67: U1.2(X1) Y1.1
N$68: U1.3(X2) Y1.2
N$69: BT1.P U1.8(VCC1)
N$72: J1.1(DAT3/CD) R16.1 R20.1
N$73: LED64.4-DIN(DI) LED72.2-DOUT(DO)
N$74: LED67.2-DOUT(DO) LED70.4-DIN(DI)
N$75: LED73.2-DOUT(DO) LED74.4-DIN(DI)
N$76: LED70.2-DOUT(DO) LED71.4-DIN(DI)
N$77: LED74.2-DOUT(DO) LED75.4-DIN(DI)
N$78: LED75.2-DOUT(DO) LED76.4-DIN(DI)
N$79: LED57.2-DOUT(DO) LED69.4-DIN(DI)
N$80: J1.2(CMD) R17.1 R19.1
N$81: LED68.4-DIN(DI) LED69.2-DOUT(DO)
N$82: J1.5(CLK) R18.1 R21.1
N$83: LED76.2-DOUT(DO) LED77.4-DIN(DI)
N$84: LED71.2-DOUT(DO) LED72.4-DIN(DI)
N$85: LED77.2-DOUT(DO) LED78.4-DIN(DI)
N$86: LED78.2-DOUT(DO) LED79.4-DIN(DI)
N$87: LED79.2-DOUT(DO) LED80.4-DIN(DI)
N$88: LED80.2-DOUT(DO) LED81.4-DIN(DI)
N$89: LED81.2-DOUT(DO) LED82.4-DIN(DI)
N$90: LED82.2-DOUT(DO) LED83.4-DIN(DI)
N$91: LED83.2-DOUT(DO) LED84.4-DIN(DI)
N$92: LED84.2-DOUT(DO) LED85.4-DIN(DI)
N$94: LED95.2-DOUT(DO) LED96.4-DIN(DI)
N$95: LED85.2-DOUT(DO) LED94.4-DIN(DI)
N$96: LED93.4-DIN(DI) LED94.2-DOUT(DO)
N$97: LED92.4-DIN(DI) LED93.2-DOUT(DO)
N$98: LED91.4-DIN(DI) LED92.2-DOUT(DO)
N$99: LED90.4-DIN(DI) LED91.2-DOUT(DO)
N$100: LED89.4-DIN(DI) LED90.2-DOUT(DO)
N$101: LED88.4-DIN(DI) LED89.2-DOUT(DO)
N$102: LED87.4-DIN(DI) LED88.2-DOUT(DO)
N$103: LED86.4-DIN(DI) LED87.2-DOUT(DO)
N$104: LED96.2-DOUT(DO) LED97.4-DIN(DI)
N$106: LED97.2-DOUT(DO) LED98.4-DIN(DI)
N$107: LED98.2-DOUT(DO) LED99.4-DIN(DI)
N$112: LED86.2-DOUT(DO) LED95.4-DIN(DI)
N$332: D226.1(A) R7.2
N$336: R6.1 SR.1(S) SR.2(S1) U2.3(EN)
N$337: R3.1 U2.13(IO19)
N$338: R4.1 U2.14(IO20)
RESET_C: U1.5(CE) U2.18(IO10)
S1: C113.2 R12.1 S1.1(S) S1.2(S1) U2.34(IO41)
S2: C18.2 R9.1 S2.1(S) S2.2(S1) U2.35(IO42)
S3: C110.2 R10.1 S3.1(S) S3.2(S1) U2.38(IO2)
S4: C114.2 R13.1 S4.1(S) S4.2(S1) U2.31(IO38)
S5: C14.2 R1.1 S5.1(S) S5.2(S1) U2.32(IO39)
S6: C17.2 R2.1 S6.1(S) S6.2(S1) U2.33(IO40)
S7: C115.2 R14.1 S7.1(S) S7.2(S1) U2.28(IO35)
S8: C111.2 R8.1 S8.1(S) S8.2(S1) U2.29(IO36)
S9: C112.2 R11.1 S9.1(S) S9.2(S1) U2.30(IO37)
SCLK: R21.2 U2.23(IO21)
USB_N: J2.A7(DN1) J2.B7(DN2) R3.2
USB_P: J2.A6(DP1) J2.B6(DP2) R4.2
Unconnected: J1.8(DAT1) J1.9(DAT2) J1.CD J1.WP J2.A5(CC1) J2.A8(SBU1) J2.B5(CC2) J2.B8(SBU2) LED99.2-DOUT(DO) U2.15(IO3) U2.16(IO46) U2.24(IO47) U2.25(IO48) U2.26(IO45) U2.36(RXD0) U2.37(TXD0)

## Library data of the parts
BT1 = untitled:BAT-HLD-010-SMT-TR_BAT-HLD-010-SMT-TR: Check availability Check availability Check availability; AVAILABILITY: In Stock; CHECK_PRICES: https://www.snapeda.com/parts/BAT-HLD-010-SMT-TR/TE+Connectivity/view-part/?ref=eda; DESCRIPTION: Battery Holder Coin 20 SMT Nickel T&R; MF: TE Connectivity; MP: BAT-HLD-010-SMT-TR; PACKAGE: None; PRICE: None; PURCHASE-URL: https://www.snapeda.com/api/url_track_click_mouser/?unipart_id=13932557&manufacturer=TE Connectivity&part_name=BAT-HLD-010-SMT-TR&search_term=None; SNAPEDA_LINK: https://www.snapeda.com/parts/BAT-HLD-010-SMT-TR/TE+Connectivity/view-part/?ref=snap
C1-C115 = untitled:Y-CAP_C: Capacitor - Generic; CATEGORY: Capacitor
D226 = untitled:1-LAYER_LED/R/5MM: LED - Generic; CATEGORY: Opto-Electronic; SUB-CATEGORY: LED
J1 = 10067847-301RLF:10067847-301RLF: Check availability; AVAILABILITY: In Stock; CHECK_PRICES: https://www.snapeda.com/parts/10067847-301RLF/Amphenol/view-part/?ref=eda; DESCRIPTION: 10067847-301RLF-T518 SD CARD CONNECTOR; MF: AMPHENOL ICC / FCI; MP: 10067847-301RLF; PACKAGE: None; PRICE: None; SNAPEDA_LINK: https://www.snapeda.com/parts/10067847-301RLF/Amphenol/view-part/?ref=snap
J2 = untitled:UJ20-C-H-C-4-SMT-TR_UJ20-C-H-C-4-SMT-TR: Check availability; AVAILABILITY: In Stock; CHECK_PRICES: https://www.snapeda.com/parts/UJ20-C-H-C-4-SMT-TR/Same+Sky/view-part/?ref=eda; DESCRIPTION: Type-C, USB 2.0, 480 Mbps, 20 Vac, 5 A, Horizontal, Copper Alloy, Surface Mount, Gold Flash, Black Insulator, USB Jack; MF: Same Sky; MP: UJ20-C-H-C-4-SMT-TR; PACKAGE: None; PRICE: None; PURCHASE-URL: https://www.snapeda.com/api/url_track_click_mouser/?unipart_id=15979477&manufacturer=Same Sky&part_name=UJ20-C-H-C-4-SMT-TR&search_term=uj20-c-h-c-4-smt-tr; SNAPEDA_LINK: https://www.snapeda.com/parts/UJ20-C-H-C-4-SMT-TR/Same+Sky/view-part/?ref=snap
JP1 = untitled:1-LAYER_PINHD-1X9: PIN HEADER
LED1-LED99 = untitled:WS2812B_WS2812B: Check availability; AVAILABILITY: Not in stock; CHECK_PRICES: https://www.snapeda.com/parts/WS2812B/Worldsemi/view-part/?ref=eda; DESCRIPTION: Intelligent control LED integrated light source; MF: Worldsemi; MP: WS2812B; PACKAGE: None; PRICE: None; SNAPEDA_LINK: https://www.snapeda.com/parts/WS2812B/Worldsemi/view-part/?ref=snap
R1-R21 = untitled:Y-RES_R: Resistor Fixed - Generic; CATEGORY: Resistor; SUB-CATEGORY: Fixed
S0 S1-S9 SR = untitled:1-LAYER_SWITCH_PCB_B3F-10-XX: OMRON SWITCH Type: B3F 10** < Alternatief (via Conrad) TE Connectivity 1825910-2; MPN: B3F-1000; OC_FARNELL: 176432; OC_NEWARK: 36M3542
U1 = untitled:DS1302ZN_T_R_DS1302ZN+T&R: Check availability; AVAILABILITY: In Stock; CHECK_PRICES: https://www.snapeda.com/parts/DS1302ZN+T&R/Analog+Devices/view-part/?ref=eda; DESCRIPTION: Trickle-Charge Timekeeping Chip; MF: Analog Devices; MP: DS1302ZN+T&amp;R; PACKAGE: SOIC-8 Maxim; PRICE: None; SNAPEDA_LINK: https://www.snapeda.com/parts/DS1302ZN+T&R/Analog+Devices/view-part/?ref=snap
U2 = untitled:Y_COMP-SET_ESP32-S3-WROOM-1-N16R2: Check availability; AVAILABILITY: In Stock; CHECK_PRICES: https://www.snapeda.com/parts/ESP32-S3-WROOM-1-N16R2/Espressif+Systems/view-part/?ref=eda; DESCRIPTION: Bluetooth, WiFi 802.11b/g/n, Bluetooth v5.0 Transceiver Module 2.4GHz PCB Trace Surface Mount; MF: Espressif Systems; MP: ESP32-S3-WROOM-1-N16R2; PACKAGE: NON STANDARD Espressif Systems; PRICE: None; SNAPEDA_LINK: https://www.snapeda.com/parts/ESP32-S3-WROOM-1-N16R2/Espressif+Systems/view-part/?ref=snap
U$1-U$3 = untitled:Y_CONECTOR_POGOPAD
VR1 = untitled:UA78M33CDCYG3_UA78M33CDCYG3: 500-mA, 30-V, linear voltage regulator 4-SOT-223 0 to 125 Check availability; AVAILABILITY: In Stock; CHECK_PRICES: https://www.snapeda.com/parts/UA78M33CDCYG3/Texas+Instruments/view-part/?ref=eda; DESCRIPTION: 500-mA, 30-V, linear voltage regulator 4-SOT-223 0 to 125; MF: Texas Instruments; MP: UA78M33CDCYG3; PACKAGE: SOT-223-4 Texas Instruments; PRICE: None; PURCHASE-URL: https://www.snapeda.com/api/url_track_click_mouser/?unipart_id=490104&manufacturer=Texas Instruments&part_name=UA78M33CDCYG3&search_term=ua78m33cdcyg3; SNAPEDA_LINK: https://www.snapeda.com/parts/UA78M33CDCYG3/Texas+Instruments/view-part/?ref=snap
Y1 = untitled:WE-XTAL_WATCH_WE-XTAL_WATCH: WE-XTAL Watch Crystals Characteristics SMT and THT models Hermetically sealed Frequency: 32.768 kHz Tolerances down to ±10 ppm available Characteristics Microprocessor Real Time Clocks Test and Measurement Equipment Battery powered Applications Details see: https://www.we-online.com/catalog/en/WE-XTAL_WATCHCRYSTAL Updated by Ella Wu, 2020-10-30 2020 (C) Wurth Elektronik Check availability; AVAILABILITY: In Stock; CHECK_PRICES: https://www.snapeda.com/parts/830014219B/Wurth+Electronics/view-part/?ref=eda; DESCRIPTION: 32.768 kHz ±20ppm Crystal 6pF 50 kOhms Cylindrical Can, Radial; MF: Würth Elektronik; MP: 830014219B; PACKAGE: None; PRICE: None; PURCHASE-URL: https://www.snapeda.com/api/url_track_click_mouser/?unipart_id=11451650&manufacturer=Würth Elektronik&part_name=830014219B&search_term=830014219b; SNAPEDA_LINK: https://www.snapeda.com/parts/830014219B/Wurth+Electronics/view-part/?ref=snap